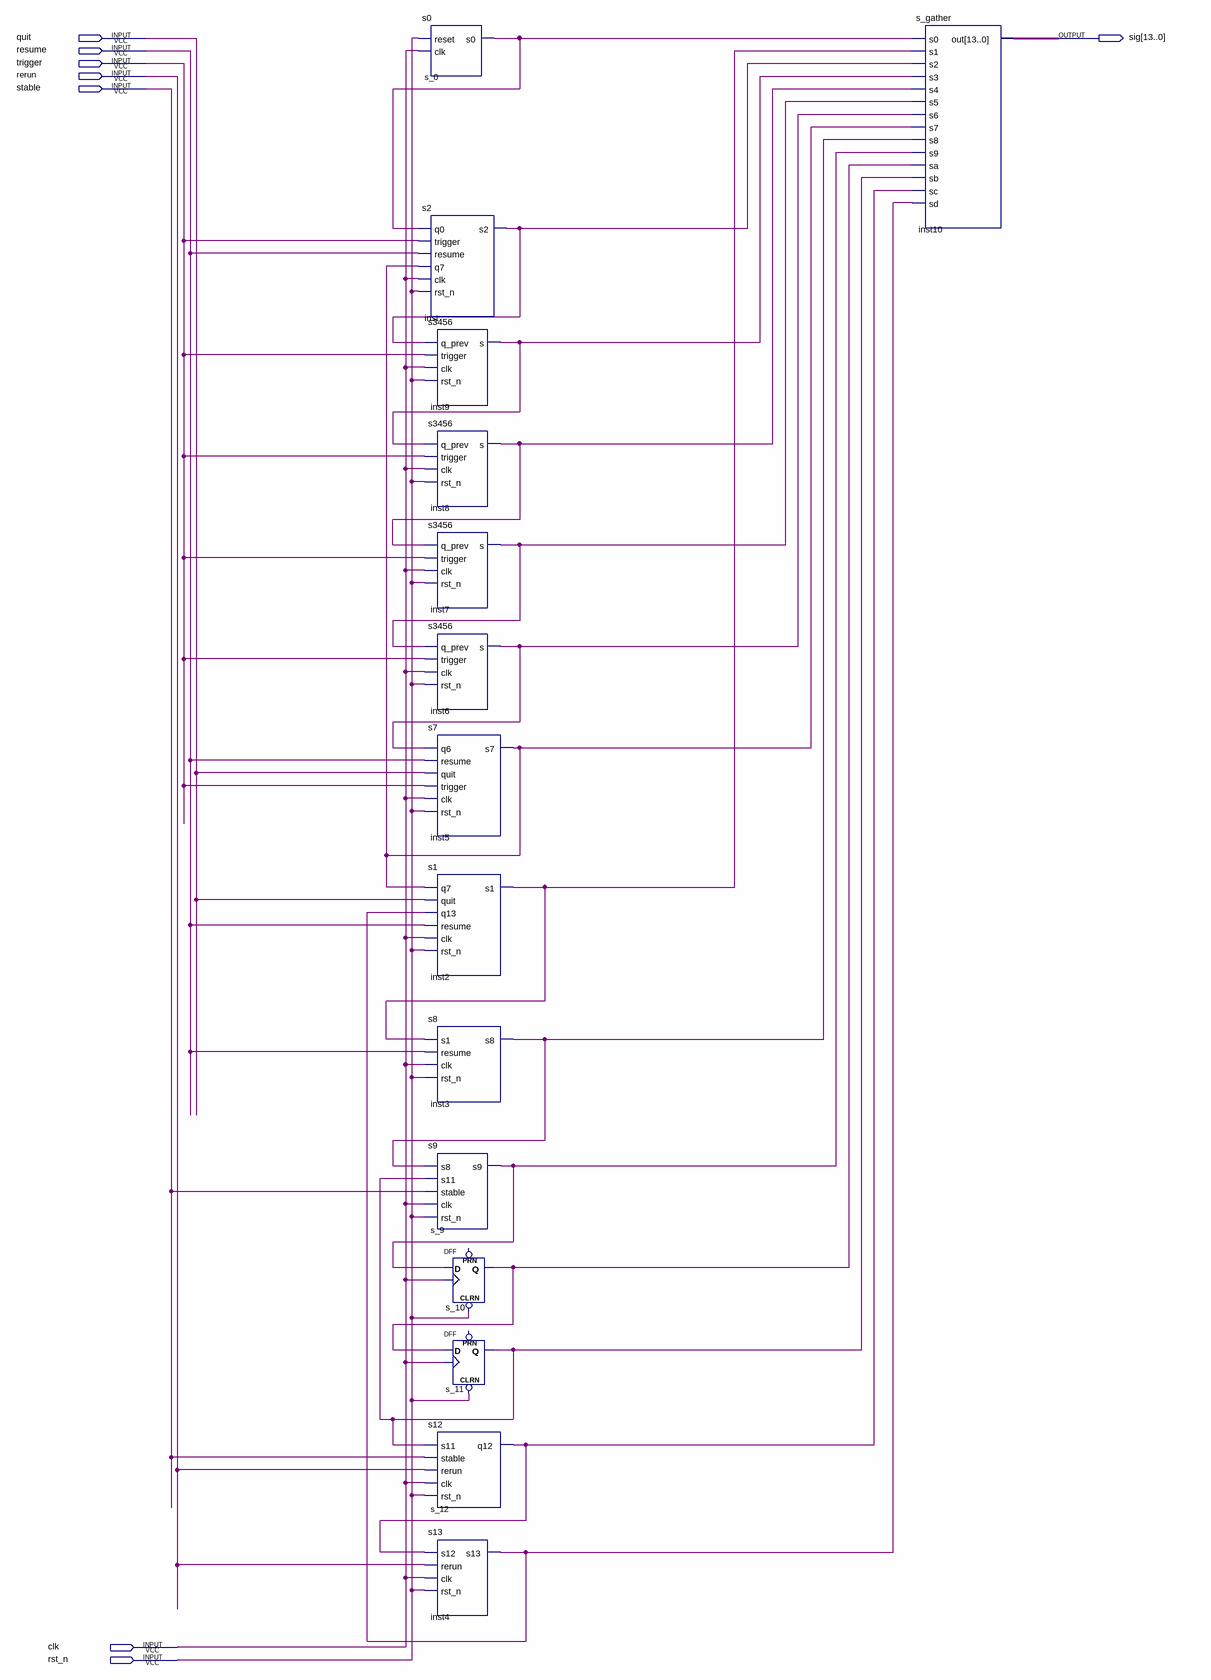
[diagram p0: schematic sheet]
// Quartus schematic ControlUnit.bdf as structural Verilog: 15 symbols, 8 pins
module ControlUnit (
  input  quit,
  input  resume,
  input  trigger,
  input  rerun,
  input  stable,
  input  clk,
  input  rst_n,
  output [13:0] sig
);

  wire inst2_s1, inst3_s8, inst4_s13, inst5_s7, inst6_s, inst7_s, inst8_s, inst9_s, inst_s2, s_0_s0, s_9_s9,
       s_10_q, s_11_q, s_12_q12;

  s0 s_0 (.reset(rst_n), .clk(clk), .s0(s_0_s0));
  s2 inst (.q0(s_0_s0), .trigger(trigger), .resume(resume), .q7(inst5_s7), .clk(clk), .rst_n(rst_n), .s2(inst_s2));
  s3456 inst9 (.q_prev(inst_s2), .trigger(trigger), .clk(clk), .rst_n(rst_n), .s(inst9_s));
  s3456 inst8 (.q_prev(inst9_s), .trigger(trigger), .clk(clk), .rst_n(rst_n), .s(inst8_s));
  s3456 inst7 (.q_prev(inst8_s), .trigger(trigger), .clk(clk), .rst_n(rst_n), .s(inst7_s));
  s3456 inst6 (.q_prev(inst7_s), .trigger(trigger), .clk(clk), .rst_n(rst_n), .s(inst6_s));
  s7 inst5 (.q6(inst6_s), .resume(resume), .quit(quit), .trigger(trigger), .clk(clk), .rst_n(rst_n), .s7(inst5_s7));
  s1 inst2 (.q7(inst5_s7), .quit(quit), .q13(inst4_s13), .resume(resume), .clk(clk), .rst_n(rst_n), .s1(inst2_s1));
  s8 inst3 (.s1(inst2_s1), .resume(resume), .clk(clk), .rst_n(rst_n), .s8(inst3_s8));
  s9 s_9 (.s8(inst3_s8), .s11(s_11_q), .stable(stable), .clk(clk), .rst_n(rst_n), .s9(s_9_s9));
  DFF s_10 (.CLRN(rst_n), .CLK(clk), .D(s_9_s9), .Q(s_10_q));  // open: PRN
  DFF s_11 (.CLRN(rst_n), .CLK(clk), .D(s_10_q), .Q(s_11_q));  // open: PRN
  s12 s_12 (.s11(s_11_q), .stable(stable), .rerun(rerun), .clk(clk), .rst_n(rst_n), .q12(s_12_q12));
  s13 inst4 (.s12(s_12_q12), .rerun(rerun), .clk(clk), .rst_n(rst_n), .s13(inst4_s13));
  s_gather inst10 (
    .s0(s_0_s0), .s1(inst2_s1), .s2(inst_s2), .s3(inst9_s), .s4(inst8_s), .s5(inst7_s), .s6(inst6_s),
    .s7(inst5_s7), .s8(inst3_s8), .s9(s_9_s9), .sa(s_10_q), .sb(s_11_q), .sc(s_12_q12), .sd(inst4_s13),
    .out(sig));
endmodule
